# EAGLE design PI CONTROLER (EAGLE 7.6.0)
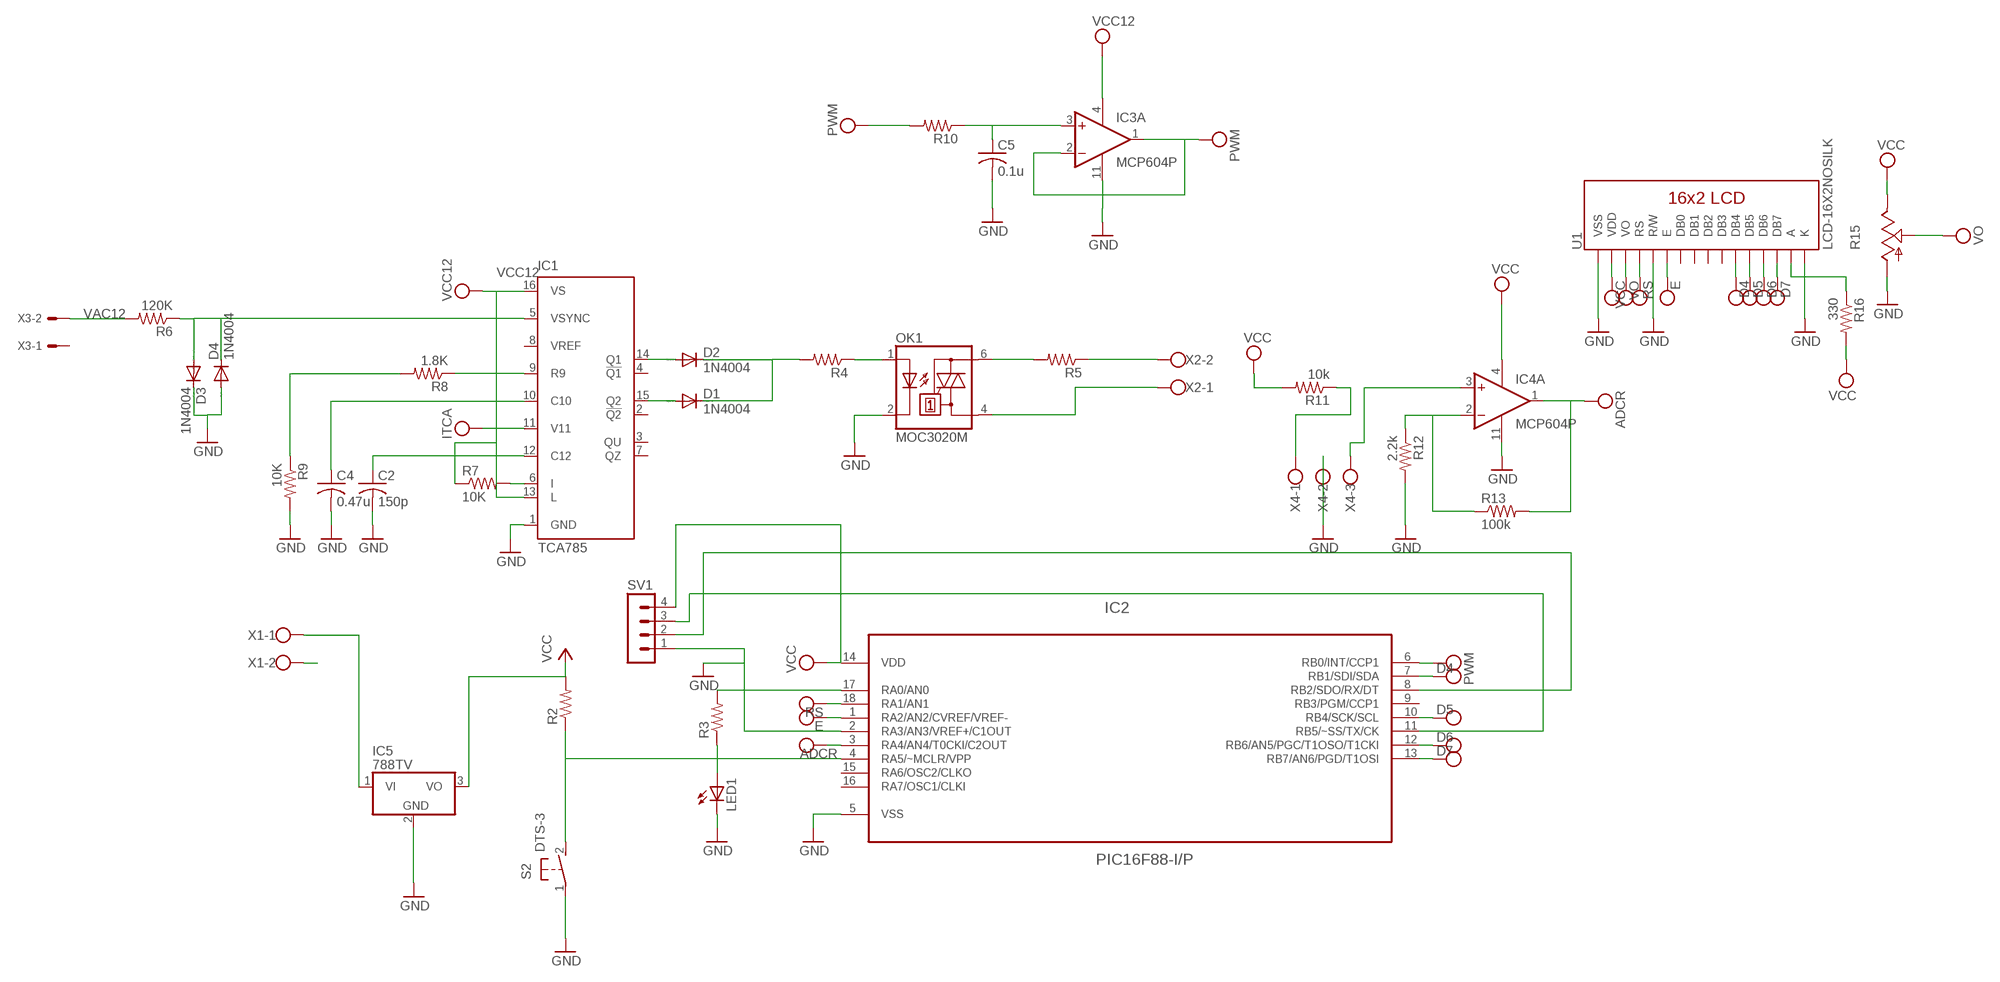
[diagram p0: schematic, sheet 1]

## Parts
C2  150p  C-US025-025X050  [C025-025X050]
C4  0.47u  C-US050-025X075  [C050-025X075]
C5  0.1u  C-US050-025X075  [C050-025X075]
D1  1N4004  [DO41-10]
D2  1N4004  [DO41-10]
D3  1N4004  [DO41-10]
D4  1N4004  [DO41-10]
IC1  TCA785  [DIL16]
IC2  PIC16F88-I/P  [DIP254P762X432-18]
IC3  MCP604P  [DIL14]
IC4  MCP604P  [DIL14]
IC5  788TV  [TO220V]
LED1  LED5MM  [LED5MM]
OK1  MOC3020M  [DIL06]
R2  R-US_0207/10  [0207/10]
R3  R-US_0207/10  [0207/10]
R4  R-US_0207/10  [0207/10]
R5  R-US_0207/10  [0207/10]
R6  120K  R-US_0207/10  [0207/10]
R7  10K  R-US_0207/10  [0207/10]
R8  1.8K  R-US_0207/10  [0207/10]
R9  10K  R-US_0207/10  [0207/10]
R10  R-US_0207/10  [0207/10]
R11  10k  R-US_0207/10  [0207/10]
R12  2.2k  R-US_0207/10  [0207/10]
R13  100k  R-US_0207/10  [0207/10]
R15  TRIM_US-RS3  [RS3]
R16  330  R-US_0207/10  [0207/10]
S2  DTS-3  [DTS-3]
SV1  MA04-1  [MA04-1]
U1  LCD-16X2NOSILK  [LCD-16X2_NOSILK]
X1  W237-102  [W237-102]
X2  W237-102  [W237-102]
X3  KK-156-2  [KK-156-2]
X4  W237-103  [W237-103]

## Nets
ADCR: IC2.3(RA4/AN4/T0CKI/C2OUT) IC4.1(A:OUT) R13.2
D4: IC2.7(RB1/SDI/SDA) U1.11(DB4)
D5: IC2.10(RB4/SCK/SCL) U1.12(DB5)
D6: IC2.12(RB6/AN5/PGC/T1OSO/T1CKI) U1.13(DB6)
D7: IC2.13(RB7/AN6/PGD/T1OSI) U1.14(DB7)
E: IC2.1(RA2/AN2/CVREF/VREF-) U1.6(E)
GND: C2.2 C4.2 C5.2 D3.C D4.A IC1.1(GND) IC2.2(RA3/AN3/VREF+/C1OUT) IC2.5(VSS) IC3.11(P:V-) IC4.11(P:V-) IC5.2(GND) LED1.K(C) OK1.2(C) R9.2 R12.2 R15.A S2.1 SV1.1 U1.1(VSS) U1.5(R/W) U1.16(K) X1.2 X4.2
ITCA: IC1.11(V11) IC3.1(A:OUT) IC3.2(A:-IN) ; supply symbol labelled PWM
N$1: IC2.4(RA5/~MCLR/VPP) R2.1 S2.2
N$2: IC2.17(RA0/AN0) R3.2
N$3: C2.1 IC1.12(C12)
N$5: IC2.11(RB5/~SS/TX/CK) SV1.3
N$6: C4.1 IC1.10(C10)
N$9: D2.A IC1.14(Q1)
N$50: LED1.A R3.1
N$58: R5.1 X2.2
N$59: D1.A IC1.15(Q2)
N$60: D1.C D2.C R4.2
N$61: OK1.1(A) R4.1
N$62: OK1.6(A2) R5.2
N$63: OK1.4(A1) X2.1
N$64: D3.A D4.C IC1.5(VSYNC) R6.1
N$65: IC1.6(I) R7.2
N$66: IC1.9(R9) R8.1
N$67: R8.2 R9.1
N$68: C5.1 IC3.3(A:+IN) R10.1
N$69: R11.1 X4.1
N$70: IC4.3(A:+IN) X4.3
N$71: IC4.2(A:-IN) R12.1 R13.1
N$72: R16.1 U1.15(A)
N$73: IC2.8(RB2/SDO/RX/DT) SV1.2
PWM: IC2.6(RB0/INT/CCP1) R10.2
RS: IC2.18(RA1/AN1) U1.4(RS)
VAC12: R6.2 X3.2
VCC: IC2.14(VDD) IC4.4(P:V+) IC5.3(VO) R2.2 R11.2 R15.E R16.2 SV1.4 U1.2(VDD)
VCC12: IC1.13(L) IC1.16(VS) IC3.4(P:V+) IC5.1(VI) R7.1 X1.1
VO: R15.S U1.3(VO)
Unconnected: IC1.2(!Q2) IC1.3(QU) IC1.4(!Q1) IC1.7(QZ) IC1.8(VREF) IC2.9(RB3/PGM/CCP1) IC2.15(RA6/OSC2/CLKO) IC2.16(RA7/OSC1/CLKI) IC3.5(B:+IN) IC3.6(B:-IN) IC3.7(B:OUT) IC3.8(C:OUT) IC3.9(C:-IN) IC3.10(C:+IN) IC3.12(D:+IN) IC3.13(D:-IN) IC3.14(D:OUT) IC4.5(B:+IN) IC4.6(B:-IN) IC4.7(B:OUT) IC4.8(C:OUT) IC4.9(C:-IN) IC4.10(C:+IN) IC4.12(D:+IN) IC4.13(D:-IN) IC4.14(D:OUT) U1.7(DB0) U1.8(DB1) U1.9(DB2) U1.10(DB3) X3.1

## Library data of the parts
C2 = adafruit:C-US: CAPACITOR, American symbol
C4 C5 = resistor:C-US: CAPACITOR, American symbol
D1-D4 = diode:1N4004: DIODE general purpose rectifier, 1 A
IC1 = infineon:TCA785: Phase Control IC Source: http://www.infineon.com/ .. tca785.pdf; OC_FARNELL: unknown; OC_NEWARK: unknown
IC2 = Microchip_By_element14_Batch_1:PIC16F88-I/P: MCU; MPN: PIC16F88-I/P; OC_FARNELL: 9761500; OC_NEWARK: 54K2830; PACKAGE: DIP-18; SUPPLIER: Microchip
IC3 IC4 = linear:MCP604: Quad Op Amp 2.7V to 6.0V Single Supply CMOS Source: http://ww1.microchip.com/downloads/en/DeviceDoc/21314g.pdf
IC5 = linear:78*: Positive VOLTAGE REGULATOR Source: http://cache.national.com/ds/LM/LM78L05.pdf http://www.fairchildsemi.com/ds/LM/LM7805.pdf
LED1 = adafruit:LED: LED OSRAM: - CHIPLED LG R971, LG N971, LY N971, LG Q971, LY Q971, LO R971, LY R971 LH N974, LH R974 LS Q976, LO Q976, LY Q976 LO Q996 - Hyper CHIPLED LW Q18S LB Q993, LB Q99A, LB R99A - SideLED LS A670, LO A670, LY A670, LG A670, LP A670 LB A673, LV A673, LT A673, LW A673 LH A674 LY A675 LS A676, LA A676, LO A676, LY A676, LW A676 LS A679, LY A679, LG A679 - Hyper Micro SIDELED® LS Y876, LA Y876, LO Y876, LY Y876 LT Y87S - SmartLED LW L88C, LW L88S LB L89C, LB L89S, LG L890 LS L89K, LO L89K, LY L89K LS L896, LA L896, LO L896, LY L896 - TOPLED LS T670, LO T670, LY T670, LG T670, LP T670 LSG T670, LSP T670, LSY T670, LOP T670, LYG T670 LG T671, LOG T671, LSG T671 LB T673, LV T673, LT T673, LW T673 LH T674 LS T676, LA T676, LO T676, LY T676, LB T676, LH T676, LSB T676, LW T676 LB T67C, LV T67C, LT T67C, LS T67K, LO T67K, LY T67K, LW E67C LS E67B, LA E67B, LO E67B, LY E67B, LB E67C, LV E67C, LT E67C LW T67C LS T679, LY T679, LG T679 LS T770, LO T770, LY T770, LG T770, LP T770 LB T773, LV T773, LT T773, LW T773 LH T774 LS E675, LA E675, LY E675, LS T675 LS T776, LA T776, LO T776, LY T776, LB T776 LHGB T686 LT T68C, LB T68C - Hyper Mini TOPLED® LB M676 - Mini TOPLED Santana® LG M470 LS M47K, LO M47K, LY M47K Source: http://www.osram.convergy.de/
OK1 = optocoupler:MOC30*M: RANDOM-PHASE OPTOISOLATORS TRIAC DRIVER OUTPUT Source: http://www.fairchildsemi.com MOC3020-M.pdf; MF: FAIRCHILD SEMICONDUCTOR; MPN: MOC3020-M; OC_FARNELL: 1505425; OC_NEWARK: 72K8895
R2-R13 R16 = resistor:R-US_: RESISTOR, American symbol
R15 = pot:TRIM_US-: POTENTIOMETER
S2 = switch-tact:DTS-3
SV1 = con-lstb:MA04-1: PIN HEADER; OC_FARNELL: unknown; OC_NEWARK: unknown
U1 = SparkFun-Displays:LCD-16X2: Standard text-only 16x2 parallel input LCD
X1 X2 = con-wago-500:W237-102: WAGO SCREW CLAMP; MPN: 237-102; OC_FARNELL: unknown; OC_NEWARK: 70K9898
X3 = con-molex:KK-156-2: KK 156 HEADER Source: http://www.molex.com/pdm_docs/sd/026604100_sd.pdf; OC_FARNELL: unknown; OC_NEWARK: unknown
X4 = con-wago-500:W237-103: WAGO SCREW CLAMP; MPN: 237-103; OC_FARNELL: unknown; OC_NEWARK: 18M7116

## Board
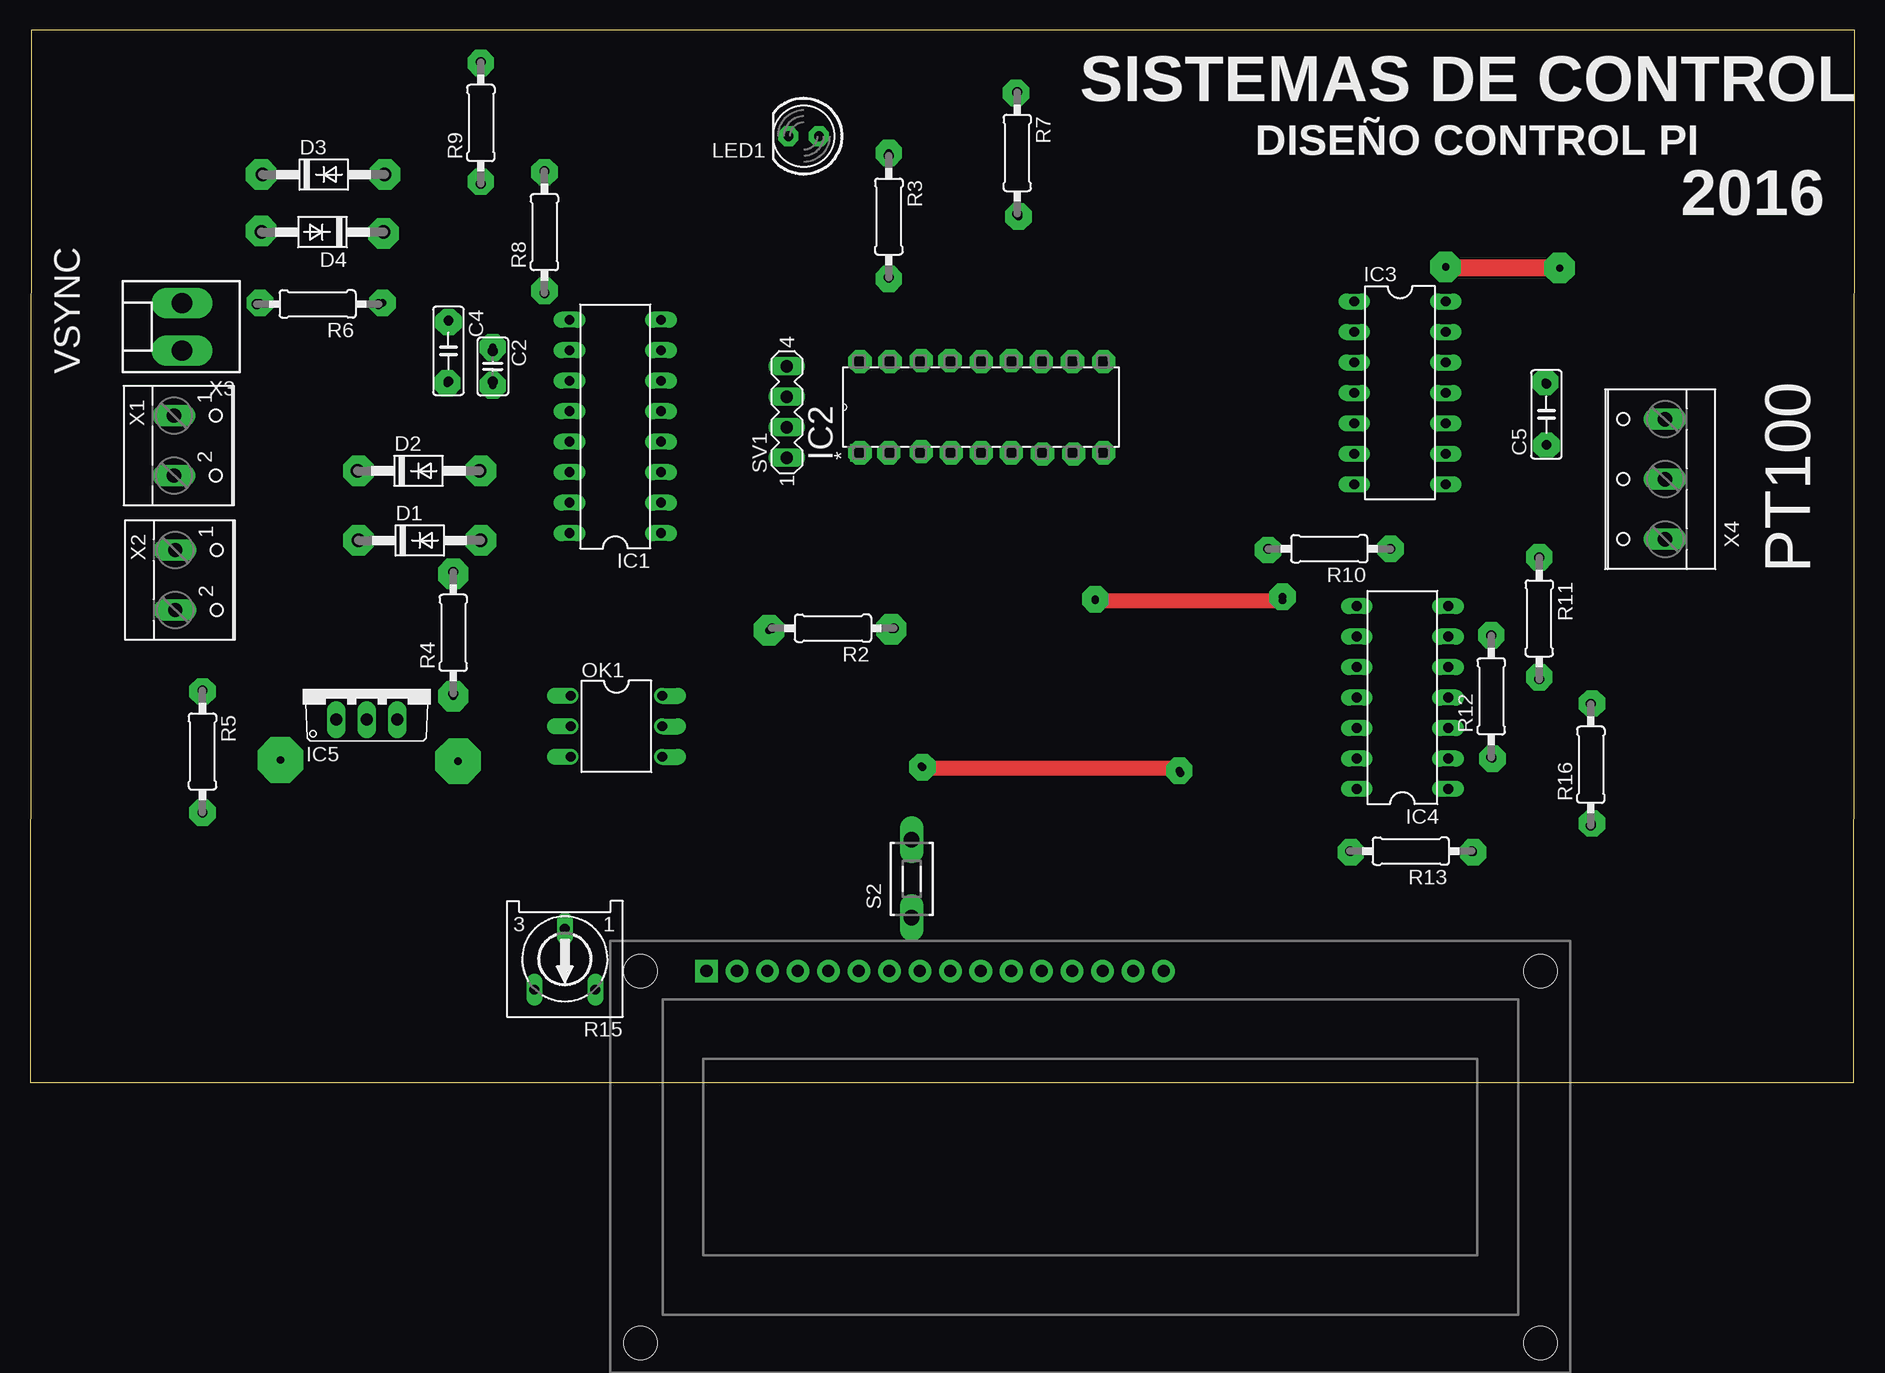
[diagram p1: board, top side]
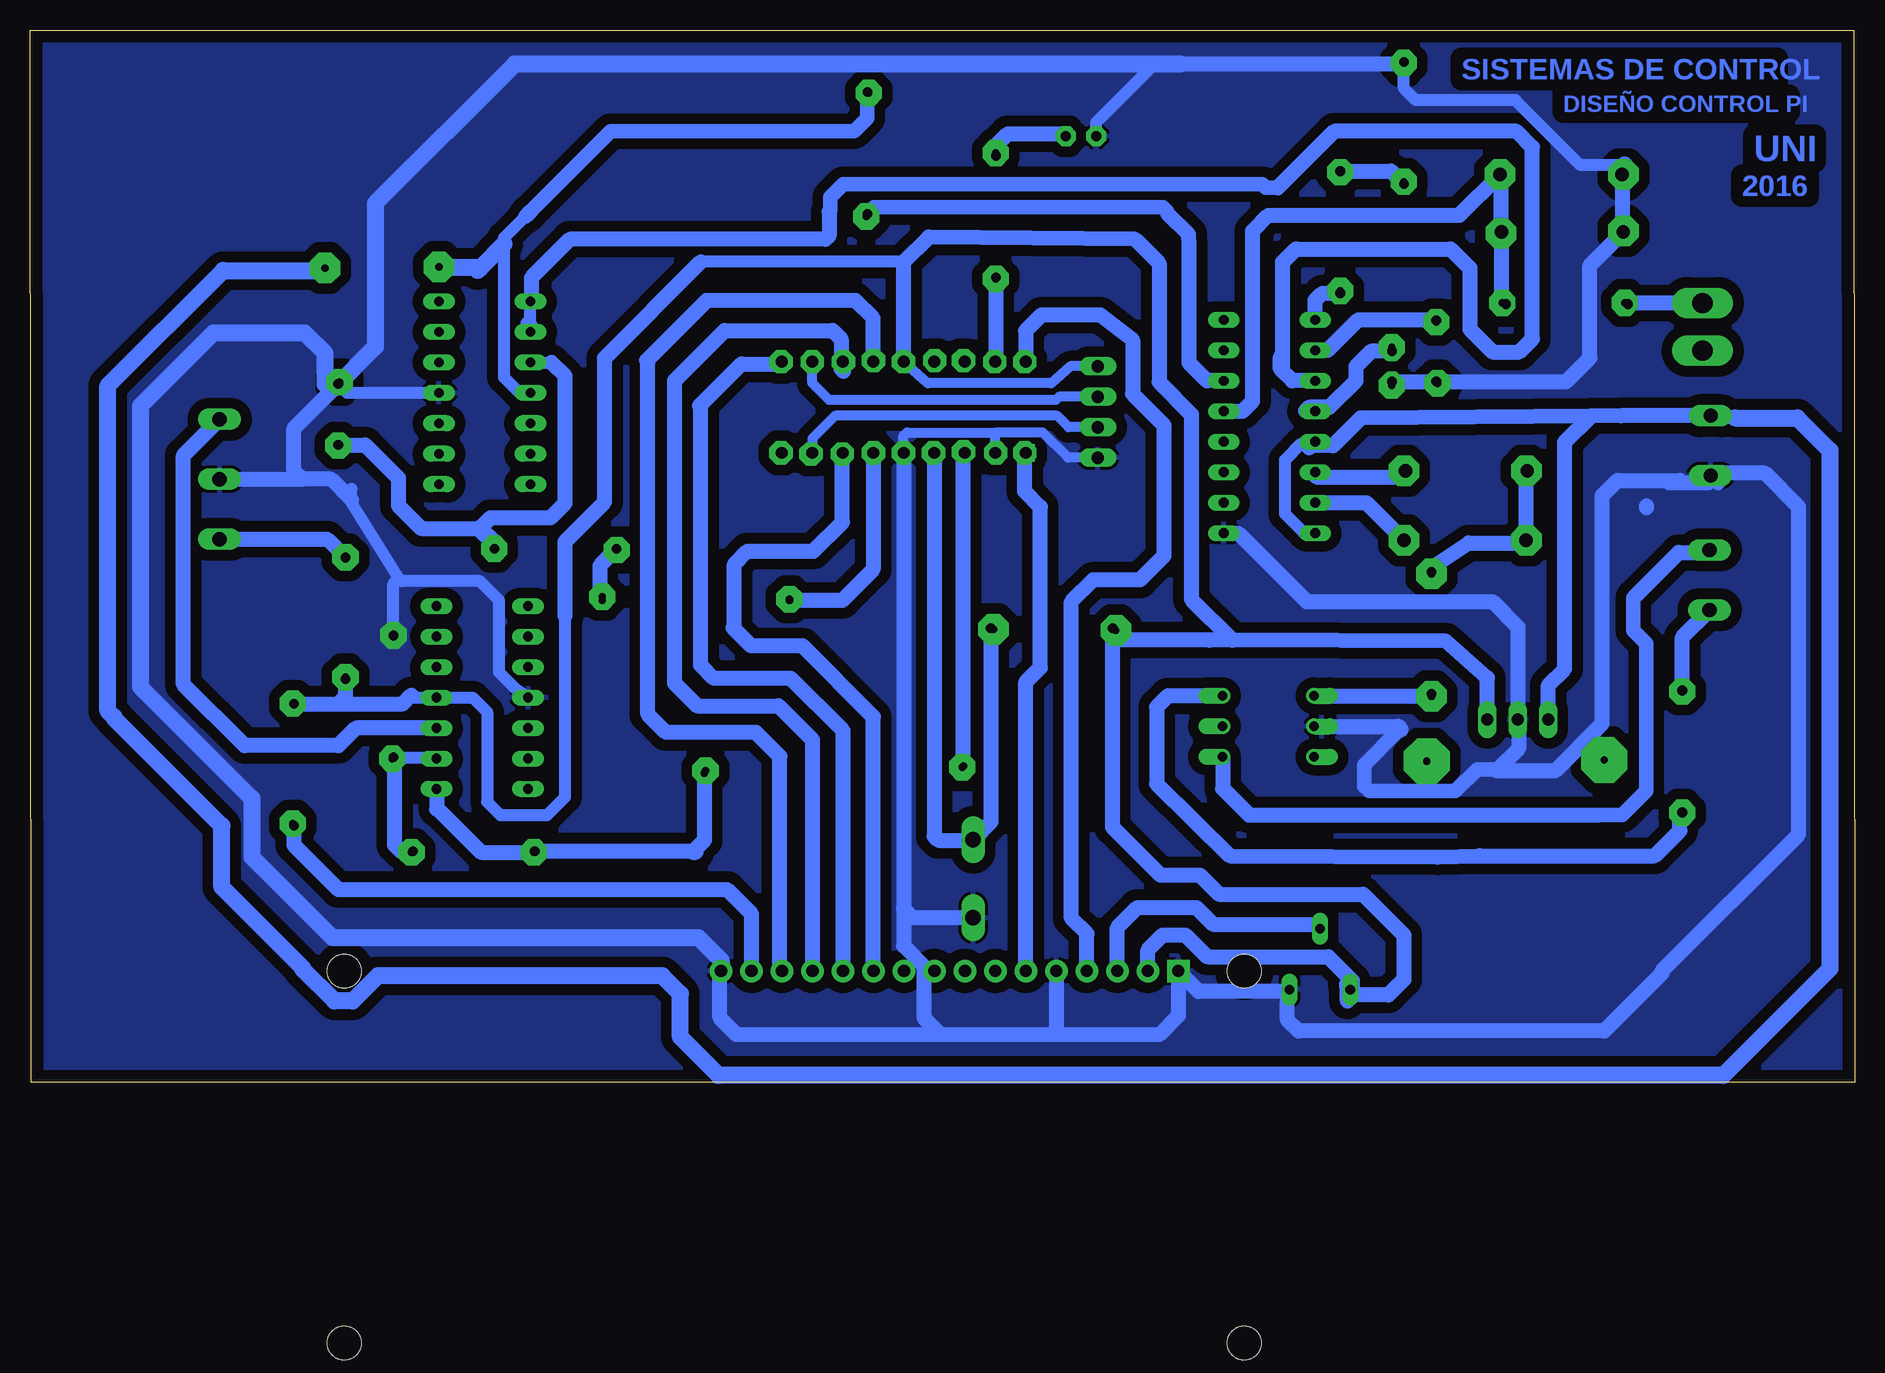
[diagram p2: board, bottom side, seen from below]

Size 152.06 x 87.73 mm. Coordinates in mm from the lower left corner, seen from the top.
Outline: 0,0 151.96,0 152.06,87.73 0.1,87.73 0,0
Copper layers (1*16): Top 0.035mm / dielectric 1.5mm / Bottom 0.035mm
Design rules "default *": minimum track width 10mil, minimum drill 24mil, track to track 35mil, track to pad 30mil, pad to pad 30mil, via to via 30mil, smd to smd 20mil, copper to edge 40mil, drill to drill 8mil, minimum pad ring 10mil, minimum via ring 8mil, stop-mask expansion 4mil, vias tented up to drill 0mil, thermal gap 10mil

### Footprints (pad centres in the part's own frame; a part is rotated, then mirrored left to right if it is on the bottom)
C025-025X050 = drill 0.813 pad 1.676 octagon: 1 -1.27,0; 2 1.27,0
C050-025X075 = drill 0.813 octagon: 1 -2.54,0; 2 2.54,0
DO41-10 = drill 1.118: A 5.08,0; C -5.08,0
DIL16 = drill 0.813 long: 1 -8.89,-3.81; 2 -6.35,-3.81; 3 -3.81,-3.81; 4 -1.27,-3.81; 5 1.27,-3.81; 6 3.81,-3.81; 7 6.35,-3.81; 8 8.89,-3.81; 9 8.89,3.81; 10 6.35,3.81; 11 3.81,3.81; 12 1.27,3.81; 13 -1.27,3.81; 14 -3.81,3.81; 15 -6.35,3.81; 16 -8.89,3.81
DIP254P762X432-18 = drill 0.991 square: 1 -7.62,20.32 | drill 0.991: 2 -7.62,17.78; 3 -7.62,15.24; 4 -7.62,12.7; 5 -7.62,10.16; 6 -7.62,7.62; 7 -7.62,5.08; 8 -7.62,2.54; 9 -7.62,0; 10 0,0; 11 0,2.54; 12 0,5.08; 13 0,7.62; 14 0,10.16; 15 0,12.7; 16 0,15.24; 17 0,17.78; 18 0,20.32
DIL14 = drill 0.813 long: 1 -7.62,-3.81; 2 -5.08,-3.81; 3 -2.54,-3.81; 4 0,-3.81; 5 2.54,-3.81; 6 5.08,-3.81; 7 7.62,-3.81; 8 7.62,3.81; 9 5.08,3.81; 10 2.54,3.81; 11 0,3.81; 12 -2.54,3.81; 13 -5.08,3.81; 14 -7.62,3.81
TO220V = drill 1.016 long: 1 -2.54,-2.54; 2 0,-2.54; 3 2.54,-2.54
LED5MM = drill 0.813 pad 1.676 octagon: A -1.27,0; K 1.27,0
DIL06 = drill 0.813 offset: 1 -2.54,-3.81; 2 0,-3.81; 3 2.54,-3.81; 4 2.54,3.81; 5 0,3.81; 6 -2.54,3.81
0207/10 = drill 0.813 octagon: 1 -5.08,0; 2 5.08,0
RS3 = drill 0.813 long: A -2.54,2.54; E 2.54,2.54; S 0,-2.54
DTS-3 = drill 1.3 long: 1 -3.25,0; 2 3.25,0
MA04-1 = drill 1.016 long: 1 -3.81,0; 2 -1.27,0; 3 1.27,0; 4 3.81,0
LCD-16X2_NOSILK = drill 1.016 pad 1.88 square: 1 -32,15.5 | drill 1.016 pad 1.88: 2 -29.46,15.5; 3 -26.92,15.5; 4 -24.38,15.5; 5 -21.84,15.5; 6 -19.3,15.5; 7 -16.76,15.5; 8 -14.22,15.5; 9 -11.68,15.5; 10 -9.14,15.5; 11 -6.6,15.5; 12 -4.06,15.5; 13 -1.52,15.5; 14 1.02,15.5; 15 3.56,15.5; 16 6.1,15.5 | hole 2.8: -37.5,15.5; -37.5,-15.5; 37.5,15.5; 37.5,-15.5
W237-102 = drill 1.194 long: 1 -2.5,-1.27; 2 2.5,-1.27
KK-156-2 = drill 1.7 pad 2.184 long: 1 -1.98,0; 2 1.98,0
W237-103 = drill 1.194 long: 1 -5,-1.29; 2 0,-1.29; 3 5,-1.29

### Placement (x,y rotation side)
C2  38.57,59.68 270 top
C4  34.87,60.98 270 top
C5  126.37,55.68 90 top
D1  32.47,45.18 0 top
D2  32.37,50.98 0 top
D3  24.47,75.68 0 top
D4  24.37,70.88 180 top
IC1  48.77,54.68 90 top
IC2  89.41,60.1 90 top
IC3  114.17,57.48 270 top
IC4  114.37,32.08 90 top
IC5  28.07,32.78 0 top
LED1  64.47,78.88 180 top
OK1  48.87,29.68 270 top
R2  66.91,37.86 180 top
R3  71.57,72.18 270 top
R4  35.27,37.48 90 top
R5  14.37,27.58 270 top
R6  23.97,64.88 180 top
R7  82.27,77.48 270 top
R8  42.87,70.88 90 top
R9  37.57,79.98 90 top
R10  108.27,44.48 180 top
R11  125.77,38.68 270 top
R12  121.77,32.18 90 top
R13  115.07,19.28 180 top
R15  44.57,10.28 180 top
R16  130.07,26.48 90 top
S2  73.47,16.98 90 top
SV1  63.07,55.88 90 top
U1  88.37,-6.22 0 top
X1  13.27,53.08 270 top
X2  13.37,41.88 270 top
X3  12.67,62.98 90 top
X4  134.97,50.28 90 top

### Tracks (layer width: path | path; a pad name or v marks a point on that pad's centre or on a via)
ADCR  (via drill 0.6, 0.6 pad 2.18)
  Top 1.27: v74.27,26.38 v74.37,26.28 74.47,26.18 95.47,26.18 v95.87,25.78
  Bottom 1.27: IC4.1 118.18,22.79 118.08,22.79 114.47,19.18 110.09,19.18 R13.2 96.67,19.28 96.57,19.18 96.87,19.18 95.87,20.18 v95.87,25.78 | v74.27,26.38 74.27,52.38 IC2.3
D4  (via drill 0.6 pad 1.93)
  Bottom 1.27: U1.11 81.77,30.48 87.67,36.38 91.97,36.38 93.47,37.88 93.37,37.98 93.37,43.18 92.27,44.28 86.77,44.28 84.37,46.68 v84.37,52.38 84.37,52.44 IC2.7
D5
  Bottom 1.27: IC2.10 89.63,59.88 92.77,59.88 96.27,56.38 96.17,56.28 96.17,34.78 95.07,33.68 88.67,33.68 84.31,29.32 U1.12
D6
  Bottom 1.27: IC2.12 84.27,60.04 84.27,59.28 84.47,59.48 84.47,61.98 85.17,62.68 94.17,62.68 98.37,58.48 98.37,33.28 96.47,31.38 89.67,31.38 86.87,28.58 86.87,9.3 U1.13
D7
  Bottom 1.27: IC2.13 81.79,63.7 83.27,65.18 95.67,65.18 100.67,60.18 100.57,60.08 100.57,30.68 99.07,29.18 91.57,29.18 89.57,27.18 89.57,9.46 U1.14
E
  Bottom 1.27: 69.07,52.46 IC2.1 69.17,52.4 69.17,49.28 67.87,47.98 67.87,34.58 69.07,33.38 U1.6
GND  (via drill 0.6 pad 1.93, 0.6 pad 2.18)
  Bottom 0.813: 79.27,52 v79.27,52.48 79.27,53.88 78.97,54.18 71.47,54.18 | IC2.2 71.67,52.52 71.67,53.98 71.47,54.18 | SV1.1 65.56,52.07 67.67,54.18 71.47,54.18
  Bottom 1.016: IC3.11 125.63,57.48 C5.2 126.41,58.18 127.47,58.18 | IC4.11 111.57,32.78 112.97,34.18 112.97,40.18 114.57,41.78 121.07,41.78 121.32,42.03 | 121.32,42.03 125.27,48.38 125.27,48.58 125.27,49.48 | R12.2 v121.77,37.28 121.77,41.58 121.32,42.03 | 19.17,76.48 22.87,76.48 28.27,81.88 36.57,81.88 37.57,82.88 37.57,84.48 37.47,84.58 | LED1.K 63.2,80.05 58.37,84.88
  Bottom 1.2: 29.97,26.08 31.47,26.08 33.27,24.28 40.47,24.28 40.87,24.68 40.87,26.48 38.07,29.28 38.07,29.68 37.97,29.68 37.77,29.48 37.77,29.38
  Bottom 1.27: D3.C 19.39,75.18 | 19.39,75.18 19.39,70.98 D4.A 22.07,68.1 22.07,60.38 24.04,58.41 34.9,58.41 | 12.57,50.38 12.17,49.98 14.37,49.98 | 12.57,50.38 12.2,50.38 X1.2 11.4,49.98 | OK1.2 38.07,29.68 | 14.37,49.98 15.47,49.98 | 17.37,48.08 17.37,47.88 | 19.17,76.28 19.17,75.4 19.39,75.18 | 12.57,50.38 12.17,50.78 7.47,50.78 4.67,47.98 4.67,20.68 16.07,9.28 16.07,9.08 20.87,4.28 46.37,4.28 47.27,5.18 47.27,7.58 | 47.27,7.58 R15.A | 47.27,7.58 54.67,7.58 U1.1 56.37,5.58 57.97,3.98 66.77,3.98 | 66.77,3.98 76.17,3.98 | 76.17,3.98 93.17,3.98 94.57,5.38 94.57,9.18 U1.16 | U1.5 66.53,4.22 66.77,3.98 | IC2.5 79.25,51.98 | 79.25,51.98 79.25,14.48 | 79.25,14.48 79.25,11.36 77.57,9.68 77.57,5.38 76.17,3.98 | S2.1 78.5,13.73 79.25,14.48 | R9.2 37.47,84.96 37.47,84.58 37.77,84.88 56.2,84.88 | C2.2 34.9,58.41 | 34.9,58.41 C4.2 | X4.2 129.37,50.28 | 125.27,48.58 126.97,50.28 129.37,50.28 | 129.37,50.28 130.07,50.98 130.07,54.52 126.79,57.8 C5.2 | 79.27,52 79.25,51.98 | 14.37,49.98 14.57,50.18 19.77,50.18 21.07,48.88 21.07,29.88 24.97,25.98 29.87,25.98 29.97,26.08 29.77,26.08 27.97,27.88 27.97,30.14 IC5.2 28.07,37.98 30.17,40.08 45.67,40.08 51.38,45.79 IC1.1
  Bottom 1.422: 127.47,58.18 127.47,60.78 129.17,62.48 136.77,62.48 142.87,56.38 142.87,32.98 133.57,23.68 133.57,18.78 126.87,12.08 96.37,12.08 94.47,10.18 U1.16 | 56.2,84.88 58.37,84.88 111.67,84.88 123.27,73.28 123.27,61.32 126.79,57.8 | 19.17,76.28 19.17,76.48
  pour Bottom: 0.1,87.76 -0.1,-0.6 152.68,-0.3 152.88,88.06
ITCA
  Bottom 1.016: IC3.2 IC3.1
  Bottom 1.2: 48.07,74.58 49.07,74.58 49.37,74.88 84.27,74.88 85.37,73.78 85.37,72.68 85.47,72.58
  Bottom 1.27: IC1.11 46.88,58.49 47.87,59.48 47.87,60.48 47.67,60.68 | 47.67,59.48 47.67,60.68 | 47.67,60.68 47.67,68.38 46.57,69.48 33.67,69.48 32.07,67.88 32.07,62.78 30.17,60.88 27.97,60.88 26.87,61.98 26.87,77.98 28.17,79.28 43.37,79.28 48.07,74.58 | 85.47,72.58 85.47,70.58 85.77,70.28 107.07,70.28 110.27,67.08 110.27,65.19 IC3.1 | IC3.2 110.36,63.07 110.37,63.08 | 110.57,63.28 110.37,63.08 | 110.37,63.08 110.47,63.08
N$1
  Bottom 1.27: R2.1 71.99,21.71 S2.2 73.52,20.18 76.37,20.18 76.71,20.52 IC2.4
N$2  (via drill 0.6 pad 2.18)
  Bottom 1.27: R3.2 v71.57,66.98 71.57,60.16 IC2.17
N$3
  Bottom 1.27: IC1.12 44.99,55.98 45.77,55.98 45.47,56.28 43.77,56.28 41.57,58.48 41.57,59.68 40.3,60.95 C2.1
N$4  (via drill 0.6 pad 2.54)
  other vias: 19.27,75.68
N$5  (via drill 0.6 pad 1.93)
  Bottom 0.813: SV1.3 66.3,57.15 66.57,56.88 85.47,56.88 86.87,58.28 v86.87,60.08 IC2.11
N$6
  Bottom 1.27: IC1.10 43.92,61.03 41.37,63.58 34.93,63.58 C4.1
N$7  (via drill 0.6 pad 2.54)
  other vias: 29.57,75.68
N$8  (via drill 0.6 pad 2.54)
  other vias: 19.27,70.98
N$9
  Bottom 1.27: IC1.14 44.96,50.57 44.87,50.48 37.95,50.48 D2.A
N$10  (via drill 0.6 pad 2.54)
  other vias: 29.47,70.78
N$11  (via drill 0.6 pad 2.54)
  other vias: 27.37,45.18
N$12  (via drill 0.6 pad 2.54)
  other vias: 27.37,50.98
N$13  (via drill 0.6 pad 2.54)
  other vias: 37.57,50.98
N$14  (via drill 0.6 pad 2.54)
  other vias: 37.57,45.18
N$15  (via drill 0.6 pad 2.54)
  other vias: 35.27,42.38
N$16  (via drill 0.6 pad 2.54)
  other vias: 35.27,32.18
N$17  (via drill 0.6 pad 2.54)
  other vias: 61.57,37.68
N$18  (via drill 0.6 pad 2.54)
  other vias: 71.77,37.78
N$19  (via drill 0.6 pad 2.18)
  other vias: 95.77,25.98
N$21  (via drill 0.6 pad 2.18)
  other vias: 88.77,40.28
N$22  (via drill 0.6 pad 2.18)
  other vias: 104.37,40.48
N$24
  pour Bottom: -0.03,87.98 -0.23,-0.42 152.17,0.08 152.37,88.48
N$25  (via drill 0.6 pad 2.18)
  other vias: 103.17,44.38
N$26  (via drill 0.6 pad 2.18)
  other vias: 113.37,44.48
N$27  (via drill 0.6 pad 2.18)
  other vias: 125.77,43.78
N$28  (via drill 0.6 pad 2.18)
  other vias: 121.87,26.98
N$29  (via drill 0.6 pad 2.18)
  other vias: 120.27,19.18
N$30  (via drill 0.6 pad 2.18)
  other vias: 110.07,19.18
N$31  (via drill 0.6 pad 2.18)
  other vias: 130.17,21.58
N$32  (via drill 0.6 pad 2.18)
  other vias: 130.17,31.58
N$35  (via drill 0.6 pad 2.18)
  other vias: 125.77,33.78
N$36  (via drill 0.6 pad 2.18)
  other vias: 126.27,58.38
N$37  (via drill 0.6 pad 2.18)
  other vias: 126.37,53.08
N$40  (via drill 0.6 pad 2.18)
  other vias: 82.37,72.18
N$41  (via drill 0.6 pad 2.18)
  other vias: 82.17,82.48
N$42  (via drill 0.6 pad 2.18)
  other vias: 37.57,75.08
N$43  (via drill 0.6 pad 2.18)
  other vias: 37.57,84.98
N$44  (via drill 0.6 pad 2.18)
  other vias: 29.37,64.98
N$45  (via drill 0.6 pad 2.18)
  other vias: 19.17,64.98
N$46  (via drill 0.6 pad 2.18)
  other vias: 14.37,32.58
N$47  (via drill 0.6 pad 2.18)
  other vias: 14.37,22.48
N$48  (via drill 0.6 pad 2.18)
  other vias: 34.87,63.38
N$49  (via drill 0.6 pad 2.18)
  other vias: 34.77,58.28
N$50  (via drill 0.6 pad 2.18)
  Bottom 1.27: R3.1 v71.57,77.48 71.57,78.08 70.57,79.08 65.94,79.08 LED1.A
N$51  (via drill 0.6 pad 2.18)
  other vias: 38.57,61.28
N$52  (via drill 0.6 pad 2.18)
  other vias: 38.57,58.08
N$53  (via drill 0.6 pad 2.18)
  other vias: 42.87,75.88
N$54  (via drill 0.6 pad 2.18)
  other vias: 42.87,65.98
N$55  (via drill 0.6 pad 1.93)
  other vias: 89.47,52.48
N$56  (via drill 0.6 pad 1.93)
  other vias: 86.97,52.38
N$57  (via drill 0.6 pad 1.93)
  other vias: 81.77,52.48
N$58
  Bottom 1.27: R5.1 14.37,37.11 X2.2
N$59
  Bottom 1.27: IC1.15 40.7,48.33 D1.A
N$60
  Bottom 1.27: D2.C 27.39,50.88 D1.C 27.59,44.98 32.17,44.98 35.27,42.88 R4.2
N$61
  Bottom 1.27: OK1.1 35.45,32.22 R4.1
N$62
  Bottom 1.27: OK1.6 57.23,32.22 58.17,31.28 58.17,24.88 52.07,18.88 34.77,18.78 31.27,18.88 16.67,18.88 14.57,20.98 14.57,22.3 R5.2
N$63
  Bottom 1.2: 21.37,22.28 19.37,22.28 17.37,24.28 17.37,36.58 18.47,37.68 18.47,40.38 18.37,40.48
  Bottom 1.27: OK1.4 52.68,24.49 50.47,22.28 21.37,22.28 | 18.37,40.48 14.67,44.18 12.3,44.18 X2.1
N$64
  Bottom 1.27: 29.45,71.48 D4.C 29.45,65.28 R6.1 | 29.45,71.48 29.45,75.58 D3.A 32.95,72.28 48.87,72.28 50.17,70.98 50.17,56.78 51,55.95 IC1.5 | 30.05,70.88 29.45,71.48
N$65
  Bottom 1.2: 57.28,72.48 57.28,72.59 57.67,72.98 81.69,72.98 R7.2
  Bottom 1.27: IC1.6 53.98,58.49 55.47,59.98 55.47,69.78 55.51,70.71 57.28,72.48
N$66
  Bottom 1.27: IC1.9 44.96,65.19 44.37,65.78 42.89,65.78 R8.1
N$67
  Bottom 1.27: R8.2 38.63,75.96 R9.1
N$68
  Bottom 1.016: IC3.3 108.61,60.02
  Bottom 1.27: 108.61,60.02 107.47,58.88 107.47,48.28 108.67,47.08 113.67,47.08 114.57,46.18 119.47,46.18 121.37,48.08 121.37,50.38 124.13,53.14 C5.1
  Bottom 1.422: R10.1 113.35,44.96 114.57,46.18
N$69
  Bottom 1.27: X4.1 127.29,45.28 R11.1
N$70
  Bottom 1.27: IC4.3 124.91,29.54 126.37,28.08 134.17,28.08 139.27,33.18 139.27,52.27 X4.3
N$71
  Bottom 1.016: R12.1 118.28,27.1 IC4.2
  Bottom 1.27: R13.1 121.17,19.28 121.67,19.78 121.67,27 R12.1
N$72
  Bottom 1.27: U1.15 91.93,14.04 93.97,16.08 126.37,16.08 130.07,19.78 R16.1
N$73
  Bottom 0.813: SV1.2 65.5,54.61 66.47,55.58 84.97,55.58 86.87,53.68 IC2.8
N$74  (via drill 0.6 pad 1.93)
  other vias: 76.77,52.48
N$75  (via drill 0.6 pad 1.93)
  other vias: 74.27,52.58
N$76  (via drill 0.6 pad 1.93)
  other vias: 71.57,52.48
N$77  (via drill 0.6 pad 1.93)
  other vias: 69.17,52.48
N$78  (via drill 0.6 pad 1.93)
  other vias: 69.17,60.08
N$79  (via drill 0.6 pad 1.93)
  other vias: 71.67,60.08
N$80  (via drill 0.6 pad 1.93)
  other vias: 74.27,60.18
N$81  (via drill 0.6 pad 1.93)
  other vias: 76.67,60.18
N$82  (via drill 0.6 pad 1.93)
  other vias: 79.27,60.08
N$83  (via drill 0.6 pad 1.93)
  other vias: 81.77,60.18
N$84  (via drill 0.6 pad 1.93)
  other vias: 84.27,60.08
N$85  (via drill 0.6 pad 1.93)
  other vias: 89.47,60.08
N$86  (via drill 0.6 pad 3.81)
  other vias: 20.87,26.88
N$87  (via drill 0.6 pad 3.81)
  other vias: 35.67,26.78
PWM  (via drill 0.6)
  Top 1.27: v88.77,40.18 v104.37,40.18
  Bottom 1.27: IC2.6 81.79,42.76 84.37,40.18 v88.77,40.18 | R10.2 103.19,44.46 104.57,43.08 104.57,40.38 v104.37,40.18
RS
  Bottom 1.27: U1.4 63.99,12.4 65.27,13.68 65.27,40.08 63.47,41.88 59.57,41.88 57.57,43.88 57.57,54.78 60.17,57.38 60.17,61.88 62.87,63.98 67.77,63.98 69.09,62.66 IC2.18
VAC12
  Bottom 1.27: X3.2 19.21,64.96 R6.2
VCC
  Bottom 0.813: SV1.4 65.36,59.69 66.97,58.28 77.23,58.28 IC2.14
  Bottom 1.016: 107.47,38.88 107.47,23.78 108.97,22.28 112.87,22.28 113.97,23.38 113.97,30.88 115.17,32.08 IC4.4 120.07,32.08 120.27,32.28 | 79.25,68.4 96.15,68.4
  Bottom 1.27: IC2.14 79.25,68.4 77.17,70.48 59.97,70.28 57.97,68.28 57.97,58.38 55.27,55.68 55.27,40.26 51.87,36.86 | IC5.3 30.61,33.72 34.07,36.78 51.87,36.86 | 51.87,36.86 53.77,36.87 61.46,36.87 61.97,37.38 61.97,37.72 R2.2 61.87,37.82 61.87,21.28 57.87,17.28 54.57,17.28 52.97,15.68 40.97,15.68 37.57,12.28 37.57,8.58 38.87,7.28 41.77,7.28 42.27,6.78 42.27,8.08 42.37,8.18 42.37,8.08 R15.E 41.87,7.9 41.87,8.48 43.87,10.48 53.97,10.48 55.77,12.28 57.67,12.28 58.91,11.04 U1.2 | 107.47,38.88 107.47,45.08 104.17,48.38 104.17,60.38 96.15,68.4 | R16.2 126.37,31.56 | 126.37,31.56 120.99,31.56 120.27,32.28 | R11.2 125.77,32.28 125.87,32.18 125.87,32.06 126.37,31.56
VCC12  (via drill 0.6 pad 2.54)
  Top 1.422: v127.47,67.88 118.07,67.88 v117.97,67.98
  Bottom 1.016: IC1.16 45.88,45.79 47.47,47.38 47.47,51.88 46.07,53.28 45.89,53.28 45.49,52.88 | 9.97,55.38 11.8,55.38 X1.1 | 110.62,72.33 110.77,72.18 112.57,70.38 112.57,69.88 112.57,58.78 111.37,57.58 110.46,57.58 IC3.4
  Bottom 1.2: R7.1 82.27,80.38 83.37,79.28 103.67,79.28 110.77,72.18
  Bottom 1.27: 45.49,52.88 45.29,53.08 | 45.29,53.08 IC1.13 | X1.1 19.47,55.58 21.97,55.56 | 21.97,55.56 41.17,55.38 43.47,53.08 45.29,53.08 | 110.37,72.58 110.62,72.33 | IC5.1 25.53,33.12 24.17,34.48 24.17,53.36 21.97,55.56
  Bottom 1.422: 9.97,55.38 4.77,55.38 2.07,52.68 2.07,9.48 10.97,0.58 94.67,0.58 97.87,3.78 97.87,7.38 99.37,8.88 123.07,8.88 125.17,6.78 126.67,6.78 129.37,9.48 129.37,9.58 136.07,16.28 136.07,21.38 145.07,30.38 145.07,30.48 145.57,30.98 145.57,58.08 135.97,67.68 127.67,67.68 v127.47,67.88 | 114.77,67.68 114.47,67.98 | 114.47,67.98 112.57,69.88 | v117.97,67.98 114.47,67.98
VO
  Bottom 1.27: U1.3 61.45,12.9 59.77,14.58 54.87,14.58 53.47,13.18 44.93,13.18 R15.S

### Text on the board
Bottom: SISTEMAS DE CONTROL | DISEÑO CONTROL PI | UNI | 2016
tNames: SISTEMAS DE CONTROL | DISEÑO CONTROL PI | 2016 | VSYNC | PT100